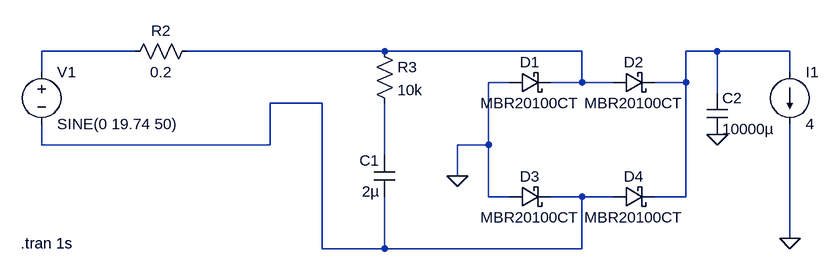
[diagram p0: schematic bridge_cap_cur.asc]
bridge_cap_cur.asc, the LTspice schematic file:
Version 4
SHEET 1 880 680
WIRE -752 -496 -896 -496
WIRE -368 -496 -672 -496
WIRE -64 -496 -368 -496
WIRE 144 -496 96 -496
WIRE 256 -496 144 -496
WIRE -896 -464 -896 -496
WIRE 256 -464 256 -496
WIRE -176 -448 -208 -448
WIRE -64 -448 -64 -496
WIRE -64 -448 -112 -448
WIRE -16 -448 -64 -448
WIRE 96 -448 96 -496
WIRE 96 -448 48 -448
WIRE 144 -432 144 -496
WIRE -464 -416 -544 -416
WIRE -896 -352 -896 -384
WIRE -544 -352 -544 -416
WIRE -544 -352 -896 -352
WIRE -208 -352 -208 -448
WIRE -208 -352 -256 -352
WIRE -368 -336 -368 -416
WIRE -256 -304 -256 -352
WIRE -208 -272 -208 -352
WIRE -176 -272 -208 -272
WIRE -64 -272 -112 -272
WIRE -16 -272 -64 -272
WIRE 96 -272 96 -448
WIRE 96 -272 48 -272
WIRE 256 -208 256 -384
WIRE -464 -192 -464 -416
WIRE -368 -192 -368 -272
WIRE -368 -192 -464 -192
WIRE -64 -192 -64 -272
WIRE -64 -192 -368 -192
FLAG -256 -304 0
FLAG 144 -368 0
FLAG 256 -208 0
SYMBOL schottky -176 -464 M90
WINDOW 0 0 32 VBottom 2
WINDOW 3 32 32 VTop 2
SYMATTR InstName D1
SYMATTR Value MBR20100CT
SYMATTR Description Diode
SYMATTR Type diode
SYMBOL schottky -16 -464 M90
WINDOW 0 0 32 VBottom 2
WINDOW 3 32 32 VTop 2
SYMATTR InstName D2
SYMATTR Value MBR20100CT
SYMATTR Description Diode
SYMATTR Type diode
SYMBOL schottky -176 -288 M90
WINDOW 0 0 32 VBottom 2
WINDOW 3 32 32 VTop 2
SYMATTR InstName D3
SYMATTR Value MBR20100CT
SYMATTR Description Diode
SYMATTR Type diode
SYMBOL schottky -16 -288 M90
WINDOW 0 0 32 VBottom 2
WINDOW 3 32 32 VTop 2
SYMATTR InstName D4
SYMATTR Value MBR20100CT
SYMATTR Description Diode
SYMATTR Type diode
SYMBOL res -656 -512 R90
WINDOW 0 0 56 VBottom 2
WINDOW 3 32 56 VTop 2
SYMATTR InstName R2
SYMATTR Value 0.2
SYMBOL voltage -896 -480 R0
WINDOW 123 0 0 Left 2
WINDOW 39 0 0 Left 2
SYMATTR InstName V1
SYMATTR Value SINE(0 19.74 50)
SYMBOL res -384 -512 R0
SYMATTR InstName R3
SYMATTR Value 10k
SYMBOL cap -352 -272 R180
WINDOW 0 24 56 Left 2
WINDOW 3 24 8 Left 2
SYMATTR InstName C1
SYMATTR Value 2µ
SYMBOL current 256 -464 R0
WINDOW 123 0 0 Left 2
WINDOW 39 0 0 Left 2
SYMATTR InstName I1
SYMATTR Value 4
SYMBOL cap 128 -432 R0
SYMATTR InstName C2
SYMATTR Value 10000µ
TEXT -928 -200 Left 2 !.tran 1s

The netlist it stands for:
* bridge_cap_cur.asc
D1 0 N002 MBR20100CT
D2 N002 N003 MBR20100CT
D3 0 N004 MBR20100CT
D4 N004 N003 MBR20100CT
R2 N002 N001 0.2
V1 N001 N004 SINE(0 19.74 50)
R3 N002 N005 10k
C1 N004 N005 2µ
I1 N003 0 4
C2 N003 0 10000µ
.model D D
.lib standard.dio
.tran 1s
.backanno
.end